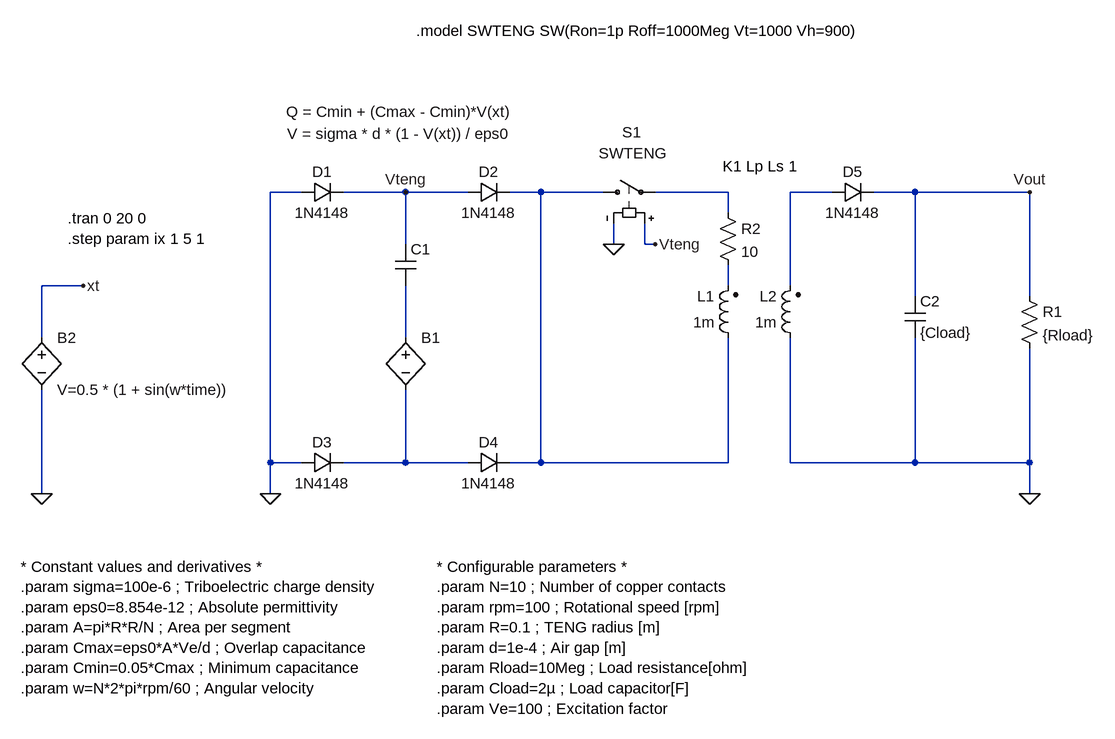
[diagram p0: schematic FSS_TENG_SW.asc]
FSS_TENG_SW.asc, the LTspice schematic file:
Version 4.1
SHEET 1 1740 1004
WIRE -112 -64 -160 -64
WIRE 48 -64 -48 -64
WIRE 144 -64 48 -64
WIRE 256 -64 208 -64
WIRE 352 -64 256 -64
WIRE 544 -64 432 -64
WIRE 704 -64 640 -64
WIRE 832 -64 768 -64
WIRE 1008 -64 832 -64
WIRE 544 -32 544 -64
WIRE 48 16 48 -64
WIRE 368 16 368 -16
WIRE 416 16 416 -16
WIRE 432 16 416 16
WIRE -448 80 -512 80
WIRE 544 80 544 48
WIRE 640 80 640 -64
WIRE 832 96 832 -64
WIRE 1008 96 1008 -64
WIRE -512 160 -512 80
WIRE 48 160 48 80
WIRE -160 352 -160 -64
WIRE -112 352 -160 352
WIRE 48 352 48 240
WIRE 48 352 -48 352
WIRE 144 352 48 352
WIRE 256 352 256 -64
WIRE 256 352 208 352
WIRE 544 352 544 160
WIRE 544 352 256 352
WIRE 640 352 640 160
WIRE 832 352 832 160
WIRE 832 352 640 352
WIRE 1008 352 1008 176
WIRE 1008 352 832 352
WIRE -512 400 -512 240
WIRE -160 400 -160 352
WIRE 1008 400 1008 352
FLAG -160 400 0
FLAG 1008 400 0
FLAG -448 80 xt
FLAG -512 400 0
FLAG 1008 -64 Vout
FLAG 48 -64 Vteng
FLAG 368 16 0
FLAG 432 16 Vteng
SYMBOL bv 48 144 R0
WINDOW 3 -182 -298 Left 2
SYMATTR Value V = sigma * d * (1 - V(xt)) / eps0
SYMATTR InstName B1
SYMBOL cap 32 16 R0
WINDOW 3 -168 -204 Left 2
SYMATTR Value Q = Cmin + (Cmax - Cmin)*V(xt)
SYMATTR InstName C1
SYMBOL diode -112 -48 R270
WINDOW 0 32 32 VTop 2
WINDOW 3 0 32 VBottom 2
SYMATTR InstName D1
SYMATTR Value 1N4148
SYMBOL diode 144 -48 R270
WINDOW 0 32 32 VTop 2
WINDOW 3 0 32 VBottom 2
SYMATTR InstName D2
SYMATTR Value 1N4148
SYMBOL diode -112 368 R270
WINDOW 0 32 32 VTop 2
WINDOW 3 0 32 VBottom 2
SYMATTR InstName D3
SYMATTR Value 1N4148
SYMBOL diode 144 368 R270
WINDOW 0 32 32 VTop 2
WINDOW 3 0 32 VBottom 2
SYMATTR InstName D4
SYMATTR Value 1N4148
SYMBOL cap 816 96 R0
SYMATTR InstName C2
SYMATTR Value {Cload}
SYMBOL res 992 80 R0
SYMATTR InstName R1
SYMATTR Value {Rload}
SYMBOL bv -512 144 R0
SYMATTR InstName B2
SYMATTR Value V=0.5 * (1 + sin(w*time))
SYMBOL sw 336 -64 R270
WINDOW 0 92 45 VRight 2
WINDOW 3 60 9 VRight 2
SYMATTR InstName S1
SYMATTR Value SWTENG
SYMBOL ind2 560 176 R180
WINDOW 0 36 80 Left 2
WINDOW 3 36 40 Left 2
SYMATTR InstName L1
SYMATTR Value 1m
SYMATTR SpiceLine Rser=1m
SYMBOL ind2 656 176 R180
WINDOW 0 36 80 Left 2
WINDOW 3 36 40 Left 2
SYMATTR InstName L2
SYMATTR Value 1m
SYMATTR SpiceLine Rser=1m
SYMBOL diode 704 -48 R270
WINDOW 0 32 32 VTop 2
WINDOW 3 0 32 VBottom 2
SYMATTR InstName D5
SYMATTR Value 1N4148
SYMBOL res 528 -48 R0
SYMATTR InstName R2
SYMATTR Value 10
TEXT -472 -24 Left 2 !.tran 0 20 0
TEXT -544 512 Left 2 !* Constant values and derivatives *\n.param sigma=100e-6 ; Triboelectric charge density\n.param eps0=8.854e-12 ; Absolute permittivity\n.param A=pi*R*R/N ; Area per segment\n.param Cmax=eps0*A*Ve/d ; Overlap capacitance\n.param Cmin=0.05*Cmax ; Minimum capacitance\n.param w=N*2*pi*rpm/60 ; Angular velocity
TEXT 96 512 Left 2 !* Configurable parameters *\n.param N=10 ; Number of copper contacts\n.param rpm=100 ; Rotational speed [rpm]\n.param R=0.1 ; TENG radius [m]\n.param d=1e-4 ; Air gap [m]\n.param Rload=10Meg ; Load resistance[ohm]\n.param Cload=2µ ; Load capacitor[F]\n.param Ve=100 ; Excitation factor
TEXT -472 8 Left 2 !.step param ix 1 5 1
TEXT 536 -104 Left 2 !K1 Lp Ls 1
TEXT 64 -312 Left 2 !.model SWTENG SW(Ron=1p Roff=1000Meg Vt=1000 Vh=900)

The netlist it stands for:
* FSS_TENG_SW.asc
B1 N005 N006 V = sigma * d * (1 - V(xt)) / eps0
C1 Vteng N005 Q = Cmin + (Cmax - Cmin)*V(xt)
D1 0 Vteng 1N4148
D2 Vteng N001 1N4148
D3 0 N006 1N4148
D4 N006 N001 1N4148
C2 Vout 0 {Cload}
R1 Vout 0 {Rload}
B2 xt 0 V=0.5 * (1 + sin(w*time))
S1 N001 N002 Vteng 0 SWTENG
L1 N001 N004 1m Rser=1m
L2 0 N003 1m Rser=1m
D5 N003 Vout 1N4148
R2 N002 N004 10
.model D D
.lib standard.dio
.tran 0 20 0
* Constant values and derivatives *
.param sigma=100e-6 ; Triboelectric charge density
.param eps0=8.854e-12 ; Absolute permittivity
.param A=pi*R*R/N ; Area per segment
.param Cmax=eps0*A*Ve/d ; Overlap capacitance
.param Cmin=0.05*Cmax ; Minimum capacitance
.param w=N*2*pi*rpm/60 ; Angular velocity
* Configurable parameters *
.param N=10 ; Number of copper contacts
.param rpm=100 ; Rotational speed [rpm]
.param R=0.1 ; TENG radius [m]
.param d=1e-4 ; Air gap [m]
.param Rload=10Meg ; Load resistance[ohm]
.param Cload=2µ ; Load capacitor[F]
.param Ve=100 ; Excitation factor
.step param ix 1 5 1
K1 Lp Ls 1
.model SWTENG SW(Ron=1p Roff=1000Meg Vt=1000 Vh=900)
.backanno
.end